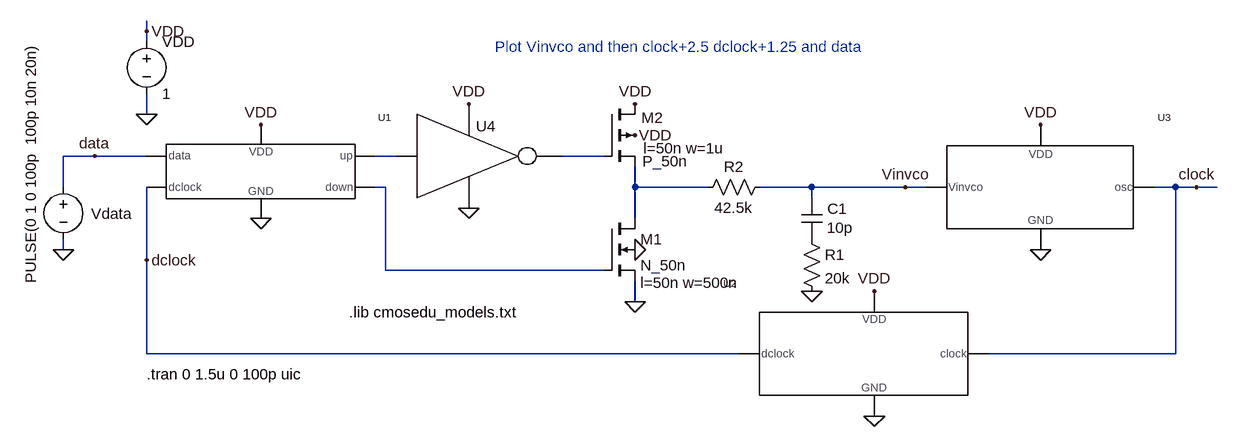
[diagram p0: schematic Fig19_35.asc]
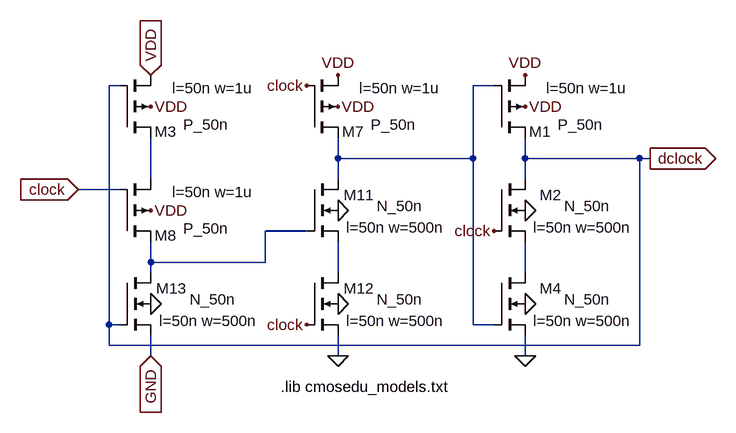
[diagram p1: sub-circuit divide_by_2.asc]
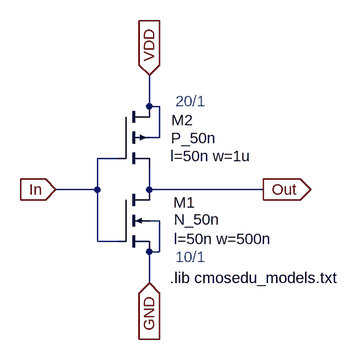
[diagram p2: sub-circuit inv_20_10.asc]
Fig19_35.asc, the LTspice schematic file:
Version 4
SHEET 1 6288 680
WIRE 1104 -640 1104 -688
WIRE 1104 -544 1104 -560
WIRE 1152 -688 1104 -688
WIRE 1232 -880 1232 -896
WIRE 1232 -864 1232 -880
WIRE 1232 -752 1232 -784
WIRE 1232 -688 1152 -688
WIRE 1232 -528 1232 -640
WIRE 1232 -384 1232 -528
WIRE 1600 -640 1584 -640
WIRE 1600 -512 1600 -640
WIRE 1616 -688 1584 -688
WIRE 1936 -688 1872 -688
WIRE 1936 -512 1600 -512
WIRE 1984 -640 1984 -672
WIRE 1984 -592 1984 -640
WIRE 1984 -464 1984 -496
WIRE 2096 -640 1984 -640
WIRE 2144 -384 1232 -384
WIRE 2256 -640 2176 -640
WIRE 2256 -624 2256 -640
WIRE 2400 -640 2256 -640
WIRE 2432 -640 2400 -640
WIRE 2816 -640 2784 -640
WIRE 2816 -384 2528 -384
WIRE 2816 -384 2816 -640
WIRE 2848 -640 2816 -640
WIRE 2880 -640 2848 -640
FLAG 1104 -544 0
FLAG 1232 -752 0
FLAG 1232 -880 VDD
FLAG 1408 -736 VDD
FLAG 1408 -592 0
FLAG 1152 -688 data
FLAG 1232 -528 dclock
FLAG 2352 -480 VDD
FLAG 2352 -288 0
FLAG 2608 -544 0
FLAG 2608 -736 VDD
FLAG 2848 -640 clock
FLAG 2400 -640 Vinvco
FLAG 1728 -768 VDD
FLAG 1728 -608 0
FLAG 1984 -544 0
FLAG 1984 -464 0
FLAG 1984 -768 VDD
FLAG 1984 -720 VDD
FLAG 2256 -480 0
SYMBOL voltage 1104 -656 R0
WINDOW 0 43 57 Left 0
WINDOW 3 -50 164 VLeft 0
WINDOW 123 0 0 Left 0
WINDOW 39 0 0 Left 0
SYMATTR InstName Vdata
SYMATTR Value PULSE(0 1 0 100p  100p 10n 20n)
SYMBOL voltage 1232 -880 R0
WINDOW 123 0 0 Left 0
WINDOW 39 0 0 Left 0
SYMATTR InstName VDD
SYMATTR Value 1
SYMBOL divide_by_2 2576 -384 M0
SYMATTR InstName U2
SYMBOL INV_20_10 1648 -752 R0
SYMATTR InstName U4
SYMBOL PFD 1184 -640 R0
SYMATTR InstName U1
SYMBOL VCO_19_18 2384 -640 R0
SYMATTR InstName U3
SYMBOL nmos4 1936 -592 R0
WINDOW 123 56 99 Left 0
SYMATTR Value2 l=50n w=500n
SYMATTR InstName M1
SYMATTR Value N_50n
SYMBOL pmos4 1936 -768 R0
WINDOW 0 58 21 Left 0
WINDOW 3 59 88 Left 0
WINDOW 123 61 68 Left 0
SYMATTR InstName M2
SYMATTR Value P_50n
SYMATTR Value2 l=50n w=1u
SYMBOL cap 2240 -624 R0
WINDOW 0 40 17 Left 0
WINDOW 3 39 46 Left 0
SYMATTR InstName C1
SYMATTR Value 10p
SYMBOL res 2240 -576 R0
SYMATTR InstName R1
SYMATTR Value 20k
SYMBOL res 2192 -656 R90
WINDOW 0 0 56 VBottom 0
WINDOW 3 32 56 VTop 0
SYMATTR InstName R2
SYMATTR Value 42.5k
TEXT 1232 -352 Left 0 !.tran 0 1.5u 0 100p uic
TEXT 1768 -856 Left 0 ;Plot Vinvco and then clock+2.5 dclock+1.25 and data
TEXT 1544 -448 Left 0 !.lib cmosedu_models.txt

divide_by_2.asc, the sub-circuit schematic file:
Version 4
SHEET 1 6288 680
WIRE 1104 -128 1104 -496
WIRE 1104 -96 1104 -128
WIRE 1120 -496 1104 -496
WIRE 1120 -336 1056 -336
WIRE 1120 -128 1104 -128
WIRE 1168 -352 1168 -416
WIRE 1168 -224 1168 -256
WIRE 1168 -208 1168 -224
WIRE 1168 -80 1168 -112
WIRE 1344 -224 1168 -224
WIRE 1344 -224 1344 -272
WIRE 1408 -272 1344 -272
WIRE 1456 -384 1456 -416
WIRE 1456 -352 1456 -384
WIRE 1456 -208 1456 -256
WIRE 1456 -80 1456 -112
WIRE 1664 -384 1456 -384
WIRE 1664 -384 1664 -496
WIRE 1664 -128 1664 -384
WIRE 1696 -496 1664 -496
WIRE 1696 -128 1664 -128
WIRE 1744 -384 1744 -416
WIRE 1744 -352 1744 -384
WIRE 1744 -208 1744 -256
WIRE 1744 -80 1744 -112
WIRE 1920 -384 1744 -384
WIRE 1920 -96 1104 -96
WIRE 1920 -96 1920 -384
WIRE 1936 -384 1920 -384
FLAG 1168 -464 VDD
FLAG 1456 -80 0
FLAG 1456 -464 VDD
FLAG 1168 -304 VDD
FLAG 1456 -304 0
FLAG 1456 -160 0
FLAG 1168 -160 0
FLAG 1456 -512 VDD
FLAG 1168 -512 VDD
IOPIN 1168 -512 In
FLAG 1168 -80 GND
IOPIN 1168 -80 In
FLAG 1744 -80 0
FLAG 1744 -464 VDD
FLAG 1744 -304 0
FLAG 1744 -160 0
FLAG 1744 -512 VDD
FLAG 1936 -384 dclock
IOPIN 1936 -384 Out
FLAG 1056 -336 clock
IOPIN 1056 -336 In
FLAG 1408 -496 clock
FLAG 1408 -128 clock
FLAG 1696 -272 clock
SYMBOL pmos4 1120 -416 M180
WINDOW 0 88 9 Right 0
WINDOW 3 168 20 Right 0
WINDOW 123 206 76 Right 0
SYMATTR InstName M3
SYMATTR Value P_50n
SYMATTR Value2 l=50n w=1u
SYMBOL pmos4 1408 -416 M180
WINDOW 0 88 9 Right 0
WINDOW 3 168 20 Right 0
WINDOW 123 206 76 Right 0
SYMATTR InstName M7
SYMATTR Value P_50n
SYMATTR Value2 l=50n w=1u
SYMBOL pmos4 1120 -256 M180
WINDOW 0 88 9 Right 0
WINDOW 3 168 20 Right 0
WINDOW 123 206 76 Right 0
SYMATTR InstName M8
SYMATTR Value P_50n
SYMATTR Value2 l=50n w=1u
SYMBOL nmos4 1408 -352 R0
WINDOW 0 104 24 Right 0
WINDOW 3 179 41 Right 0
WINDOW 123 213 74 Right 0
SYMATTR InstName M11
SYMATTR Value N_50n
SYMATTR Value2 l=50n w=500n
SYMBOL nmos4 1408 -208 R0
WINDOW 0 104 24 Right 0
WINDOW 3 179 41 Right 0
WINDOW 123 213 74 Right 0
SYMATTR InstName M12
SYMATTR Value N_50n
SYMATTR Value2 l=50n w=500n
SYMBOL nmos4 1120 -208 R0
WINDOW 0 104 24 Right 0
WINDOW 3 179 41 Right 0
WINDOW 123 213 74 Right 0
SYMATTR InstName M13
SYMATTR Value N_50n
SYMATTR Value2 l=50n w=500n
SYMBOL pmos4 1696 -416 M180
WINDOW 0 88 9 Right 0
WINDOW 3 168 20 Right 0
WINDOW 123 206 76 Right 0
SYMATTR InstName M1
SYMATTR Value P_50n
SYMATTR Value2 l=50n w=1u
SYMBOL nmos4 1696 -352 R0
WINDOW 0 104 24 Right 0
WINDOW 3 179 41 Right 0
WINDOW 123 213 74 Right 0
SYMATTR InstName M2
SYMATTR Value N_50n
SYMATTR Value2 l=50n w=500n
SYMBOL nmos4 1696 -208 R0
WINDOW 0 104 24 Right 0
WINDOW 3 179 41 Right 0
WINDOW 123 213 74 Right 0
SYMATTR InstName M4
SYMATTR Value N_50n
SYMATTR Value2 l=50n w=500n
TEXT 1368 -32 Left 0 !.lib cmosedu_models.txt

inv_20_10.asc, the sub-circuit schematic file:
Version 4
SHEET 1 1136 680
WIRE 368 -176 304 -176
WIRE 368 -176 368 -224
WIRE 368 -96 368 -176
WIRE 400 -224 368 -224
WIRE 400 -96 368 -96
WIRE 448 -304 448 -352
WIRE 448 -176 448 -208
WIRE 448 -32 448 -80
WIRE 464 -304 448 -304
WIRE 464 -256 448 -256
WIRE 464 -256 464 -304
WIRE 464 -128 448 -128
WIRE 464 -80 448 -80
WIRE 464 -80 464 -128
WIRE 624 -176 448 -176
FLAG 304 -176 In
IOPIN 304 -176 In
FLAG 448 -352 VDD
IOPIN 448 -352 In
FLAG 448 -32 GND
IOPIN 448 -32 In
FLAG 624 -176 Out
IOPIN 624 -176 Out
SYMBOL nmos4 400 -176 R0
WINDOW 0 119 20 Right 0
WINDOW 3 157 46 Right 0
WINDOW 123 238 76 Right 0
SYMATTR InstName M1
SYMATTR Value N_50n
SYMATTR Value2 l=50n w=500n
SYMBOL pmos4 400 -304 R0
WINDOW 0 116 21 Right 0
WINDOW 3 151 49 Right 0
WINDOW 123 206 76 Right 0
SYMATTR InstName M2
SYMATTR Value P_50n
SYMATTR Value2 l=50n w=1u
TEXT 488 -312 Left 0 ;20/1
TEXT 488 -72 Left 0 ;10/1
TEXT 480 -40 Left 0 !.lib cmosedu_models.txt

The netlist it stands for:
* Fig19_35.asc
Vdata data 0 PULSE(0 1 0 100p  100p 10n 20n)
VDD VDD 0 1
XU2 clock dclock VDD 0 divide_by_2
XU4 N002 N003 VDD 0 inv_20_10
XU1 data dclock N002 N001 VDD 0 PFD  ; pins data dclock up down VDD GND
XU3 Vinvco clock VDD 0 VCO_19_18  ; pins Vinvco osc VDD GND
M1 N004 N001 0 0 N_50n l=50n w=500n
M2 VDD N003 N004 VDD P_50n l=50n w=1u
C1 Vinvco P001 10p
R1 P001 0 20k
R2 Vinvco N004 42.5k

* block symbol definitions
.subckt divide_by_2 clock dclock VDD GND
M3 N001 dclock VDD VDD P_50n l=50n w=1u
M7 N003 clock VDD VDD P_50n l=50n w=1u
M8 N002 clock N001 VDD P_50n l=50n w=1u
M11 N003 N002 N004 0 N_50n l=50n w=500n
M12 N004 clock 0 0 N_50n l=50n w=500n
M13 N002 dclock GND 0 N_50n l=50n w=500n
M1 dclock N003 VDD VDD P_50n l=50n w=1u
M2 dclock clock N005 0 N_50n l=50n w=500n
M4 N005 N003 0 0 N_50n l=50n w=500n
.lib cmosedu_models.txt
.ends divide_by_2

.subckt inv_20_10 In Out VDD GND
M1 Out In GND GND N_50n l=50n w=500n
M2 VDD In Out VDD P_50n l=50n w=1u
* 20/1
* 10/1
.lib cmosedu_models.txt
.ends inv_20_10

.model NMOS NMOS
.model PMOS PMOS
.lib standard.mos
.tran 0 1.5u 0 100p uic
* Plot Vinvco and then clock+2.5 dclock+1.25 and data
.lib cmosedu_models.txt
.backanno
.end